# Altium schematic sheet subDACOut.SchDoc
size A4
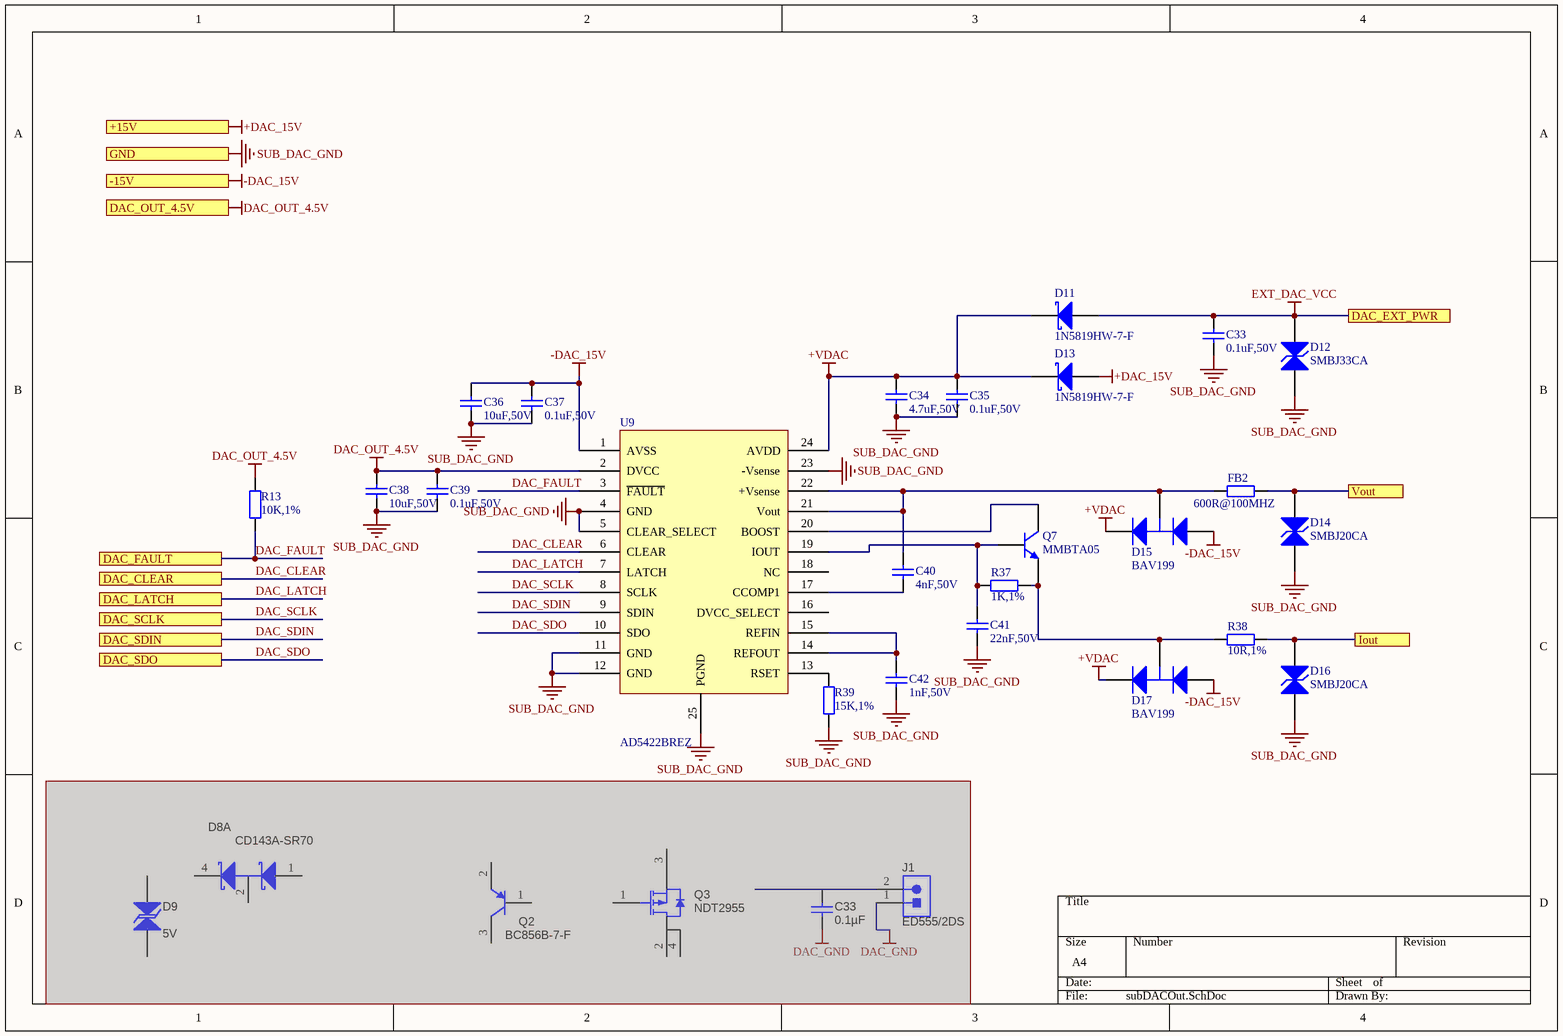
[diagram p0: subDACOut.SchDoc]

## Parts
(Parts that share a designator on the sheet are numbered #1, #2 ... from top to bottom, then left to right.)
C33#1  0.1uF,50V  [C0603]
C33#2  ValueDisplayed: 0.1µF  [0603]  (hidden comment: GRM188R71H104KA93D)  (masked out: inside a compile mask, not in the netlist)
C34  4.7uF,50V  [C0805]
C35  0.1uF,50V  [C0603]
C36  10uF,50V  [C0805]
C37  0.1uF,50V  [C0603]
C38  10uF,50V  [C0805]
C39  0.1uF,50V  [C0603]
C40  4nF,50V  [C0603]
C41  22nF,50V  [C0603]
C42  1nF,50V  [C0603]
D8  CD143A-SR70  [SOT-143-4]  (part A of 2)  (masked out: inside a compile mask, not in the netlist)
D9  value 5V  [SOD-323-Bi]  (hidden comment: CDSOD323-T05)  (masked out: inside a compile mask, not in the netlist)
D11  1N5819HW-7-F  [SOD-123_L2.8-W1.8-LS3.7-FD]
D12  SMBJ33CA  [SMB_L4.6-W3.6-LS5.3-BI]
D13  1N5819HW-7-F  [SOD-123_L2.8-W1.8-LS3.7-FD]
D14  SMBJ20CA  [SMB_L4.6-W3.6-LS5.3-BI]
D15  BAV199  [SOT-23]
D16  SMBJ20CA  [SMB_L4.6-W3.6-LS5.3-BI]
D17  BAV199  [SOT-23]
FB2  600R@100MHZ  [L0805]
J1  ED555/2DS  [TERM_BLK_ED555-2DS]  (masked out: inside a compile mask, not in the netlist)
Q2  BC856B-7-F  [SOT-23]  (masked out: inside a compile mask, not in the netlist)
Q3  NDT2955  [SOT-223]  (masked out: inside a compile mask, not in the netlist)
Q7  MMBTA05  [SOT-23_NPN]
R13  10K,1%  [R0603]
R37  1K,1%  [R0603]
R38  10R,1%  [R0805]
R39  15K,1%  [R0603]
U9  AD5422BREZ  [TSSOP-24_L7.8-W4.4-P0.65-LS6.4-BL-EP]

## Ports
+15V, -15V, DAC_CLEAR, DAC_EXT_PWR, DAC_FAULT, DAC_LATCH, DAC_OUT_4.5V, DAC_SCLK, DAC_SDIN, DAC_SDO, GND, Iout, Vout

## Nets
+DAC_15V: D13.1(A) ; port +15V
+VDAC: C34.1 C35.1 D11.2(K) D13.2(K) D15.2(K) D17.2(K) U9.24(AVDD)
-DAC_15V: C36.1 C37.1 D15.1(A) D17.1(A) U9.1(AVSS) ; port -15V
DAC_OUT_4.5V: C38.1 C39.1 R13.1 U9.2(DVCC) ; port DAC_OUT_4.5V
EXT_DAC_VCC: C33#1.1 D11.1(A) D12.2(A) ; port DAC_EXT_PWR
SUB_DAC_GND: C33#1.2 C34.2 C35.2 C36.2 C37.2 C38.2 C39.2 C41.2 C42.2 D12.1(A) D14.1(A) D16.1(A) R39.2 U9.4(GND) U9.5(CLEAR_SELECT) U9.11(GND) U9.12(GND) U9.23(-Vsense) U9.25(PGND) ; port GND
DAC_CLEAR: U9.6(CLEAR) ; port DAC_CLEAR
DAC_FAULT: R13.2 U9.3(~{FAULT}) ; port DAC_FAULT
DAC_LATCH: U9.7(LATCH) ; port DAC_LATCH
DAC_SCLK: U9.8(SCLK) ; port DAC_SCLK
DAC_SDIN: U9.9(SDIN) ; port DAC_SDIN
DAC_SDO: U9.10(SDO) ; port DAC_SDO
Iout: D16.2(A) R38.2 ; port Iout
Vout: D14.2(A) FB2.2 ; port Vout
NetC40_1: C40.1 D15.3(C) FB2.1 U9.21(Vout) U9.22(+Vsense)
NetC40_2: C40.2 U9.17(CCOMP1)
NetC41_1: C41.1 Q7.B R37.1 U9.19(IOUT)
NetC42_1: C42.1 U9.14(REFOUT) U9.15(REFIN)
NetD17_3: D17.3(C) Q7.E R37.2 R38.1
NetQ7_C: Q7.C U9.20(BOOST)
NetR39_1: R39.1 U9.13(RSET)

Not connected (* = marked no-connect by the designer): U9 16(DVCC_SELECT) 18(NC)

## Library data of the parts
C33#1 C34-C42 = CAP: Capacitor; Fitted: True
C33#2 = GRM188R71H104KA93D: CAP, CERM, 0.1uF, 50V, +/-10%, X7R, 0603; Manufacturer: MuRata; Polarized: N; CompType: Capacitor; U/M: EA; Cap_F: 0.0000001; Tolerance_%: 10; VDC_V: 50; TaMin_C: -55; TaMax_C: 125; SymbolVersion: 2008-07-09; Value: 0.1uF; PartNumber: GRM188R71H104KA93D; PackageReference: 0603; RoHS: Y; Value1: ?; Value2: 50V; MountType: SMT; Technology: Ceramic; TempCo: X7R; Cap_Case: 0603; Published: 2008-06-19; Publisher: Texas Instruments; LatestRevisionDate: 2012-04-11; LatestRevisionNote: Changed publisher; ComponentLink1Description: Datasheet link; ComponentLink1URL: http://search.murata.co.jp/Ceramy/PnsearchViewAction.do?HnOFG=ON&HnNFG=ON&SEL_CNT=50&sLang=en&sKey=GRM188R71H104KA93D&x=9&y=9&search=startwith; Alternate PartNumber: -; Alternate Manufacturer: -; Supplier 1: Digi-Key; Supplier Part Number 1: 490-1519-1-ND; Supplier 2: Farnell; Supplier Part Number 2: 1118182; Supplier 3: Arrow; Supplier Part Number 3: GRM188R71H104KA93D
D8 = CD143A-SR70: IC TVS ARRAY 2-LINE 70V SOT-143; Manufacturer: Bourns; SymbolVersion: use current date i.e. 2008-05-20; SymbolCreator: Use LDAP id; U/M: EA, IN, or GM; MountType: SMT; RoHS: y; PartNumber: CD143A-SR70; PackageReference: TO-253-4; ComponentLink1Description: Datasheet Link; ComponentLink1URL: http://www.digikey.com/product-detail/en/CD143A-SR70/CD143A-SR70CT-ND/1630599; CompType: TVS; Alternate PartNumber: -; Alternate Manufacturer: -; Supplier Part Number 1: CD143A-SR70CT-ND
D9 = CDSOD323-T05C: TVS DIODE 5VWM 9.8VC SOD323; Manufacturer: Bourns; U/M: EA; Power_W: 350; Vr_V: 5; Value1: 350W; AEC Category: Q101; CompType: TVS; SymbolVersion: 2012-01-13; PartNumber: CDSOD323-T05; PackageReference: SOD323, 2-Leads, Body 1.9x1.45mm, No Polarity Mark; Vz_V: N/A; MountType: SMT; RoHS: Y; ComponentLink1Description: Datasheet link; ComponentLink1URL: http://www.bourns.com/data/global/pdfs/CDSOD323-TxxC.PDF; Published: 2008-10-08; Publisher: Texas Instruments; LatestRevisionDate: 2015-10-06; LatestRevisionNote: Updated Supplier Data; Supplier 1: Digi-Key; Supplier Part Number 1: CDSOD323-T05CT-ND; AEC Qualified: ?
D11 D13 = D Schottky: Schottky Diode; Published: 8-Jun-2000; LatestRevisionDate: 17-Jul-2002; LatestRevisionNote: Re-released for DXP Platform.; PackageReference: SMB; Publisher: Altium Limited; PackageDescription: DO-214-AA/SMB; 2 C-Bend Leads; Body 5.3 x 3.6 mm, inc. leads (LxW); Code_JEDEC: DO-214-AA
D12 D14 D16 = SMBJ12CA: Transient Voltage  Suppressors (TVS)
D15 D17 = BAV199: Silicon Low-Leakage Diode Array connected in series; Published: 8-Jun-2000; DatasheetDocument: Oct-1999; PackageDocument: Sep-2001; PackageReference: SOT-23; Publisher: Altium Limited; ComponentLink1Description: Manufacturer Link; ComponentLink1URL: http://www.infineon.com/; ComponentLink2Description: Datasheet; ComponentLink2URL: http://www.infineon.com/upload/Document/cmc_upload/documents/009/441/bav199series_1.pdf
FB2 = 电阻: Value: 3.3K, 10%; Type: 贴片电阻
J1 = ED555/2DS: Terminal Block, 6A, 3.5mm Pitch, 2-Pos, TH; Manufacturer: On-Shore Technology; SymbolCreator: a0412235; CompType: Connector; U/M: EA; SymbolVersion: 2013-10-31; PartNumber: ED555/2DS; PackageReference: 7.0x8.2x6.5mm; RoHS: Y; MountType: TH; ComponentLink1Description: Datasheet Link; ComponentLink1URL: http://on-shore.com/sites/default/files/manuals/ed555ds.pdf; Publisher: Texas Instruments; LatestRevisionDate: 2015-10-01; Supplier 1: Digi-Key; Supplier Part Number 1: ED1514-ND
Q2 = BC856B-7-F, Diodes Inc.: Transistor, PNP, 65 V, 0.1 A, SOT-23; CompType: BJT; PNP: 1; NPN: 0; Vceo_V: 65; Vcesat1_V: 0.075; Value: 65 V; IcRated_A: 0.1; Value1: 0.1 A; HfeMax: 330; TaMin_C: -65; TaMax_C: 150; U/M: EA; AEC Category: Q101; SymbolVersion: 2008-07-31; PartNumber: BC856B-7-F; Manufacturer: Diodes Inc.; PackageReference: SOT-23; RoHS: Y; Value2: 330; Published: 2008-07-31; LatestRevisionDate: 2015-09-25; Publisher: Texas Instruments; ComponentLink1Description: Datasheet link; ComponentLink1URL: http://www.diodes.com/datasheets/ds11207.pdf; Supplier 1: Digi-Key; Supplier Part Number 1: BC856B-7FDICT-ND; Supplier 2: Farnell; Supplier Part Number 2: 1773623; MountType: SMT; AEC Qualified: ?
Q3 = NDT2955: MOSFET, P-CH, -60 V, -2.5 A, SOT-223; Manufacturer: Fairchild Semiconductor; Alternate Manufacturer: None; SymbolCreator: a0799628; U/M: EA; ChType: P; Value: -60V; Value1: 0.5 ohm; Rdson45_ohm: 0.5; Value2: 11 nC; QgTyp_nC: 11; Vgs_V: 20; AEC Category: Q101; SymbolVersion: 2013-04-29; PartNumber: NDT2955; PackageReference: SOT-223; CompType: MOSFET; VdsMax_V: -60; IdsMax_A: -2.5; RoHS: Y; MountType: SMT; Published: 2008-06-19; Publisher: Texas Instruments; LatestRevisionDate: 2015-10-01; LatestRevisionNote: Added parts.; ComponentLink1Description: Datasheet link; ComponentLink1URL: http://www.fairchildsemi.com/ds/ND/NDT2955.pdf; Supplier 1: Digi-Key; Supplier Part Number 1: NDT2955CT-ND; Supplier 2: Mouser; Supplier Part Number 2: 512-NDT2955; Supplier 3: Farnell; Supplier Part Number 3: 2323215; AEC Qualified: ?
Q7 = S8050: NPN General Purpose Amplifier; Published: 8-Jun-2000; LatestRevisionDate: 15-Jan-2003; LatestRevisionNote: PCB Footprint 'BCY-W3/D4.7' replaced; DatasheetVersion: 1997; PackageVersion: Sep-1998; PackageReference: TO-92A; Publisher: Altium Limited; PackageDescription: TO, Flat Index; 3 In-Line, Axial Leads; Body Dia. 4.5mm; Leads 0.51 x 0.48 mm (max); ComponentLink1Description: Manufacturer Link; ComponentLink1URL: http://www.fairchildsemi.com/; ComponentLink2Description: Datasheet; ComponentLink2URL: http://www.fairchildsemi.com/ds/2N%2F2N3904.pdf
R13 R37-R39 = 电阻: Value: 3.3K, 10%; Type: 贴片电阻
U9 = AD5422BREZ: 单通道、12/16位、串行输入、内置电流源 / 和电压输出DAC，具有HART连接能力